# Altium schematic sheet 2 - Control.SchDoc
size A4
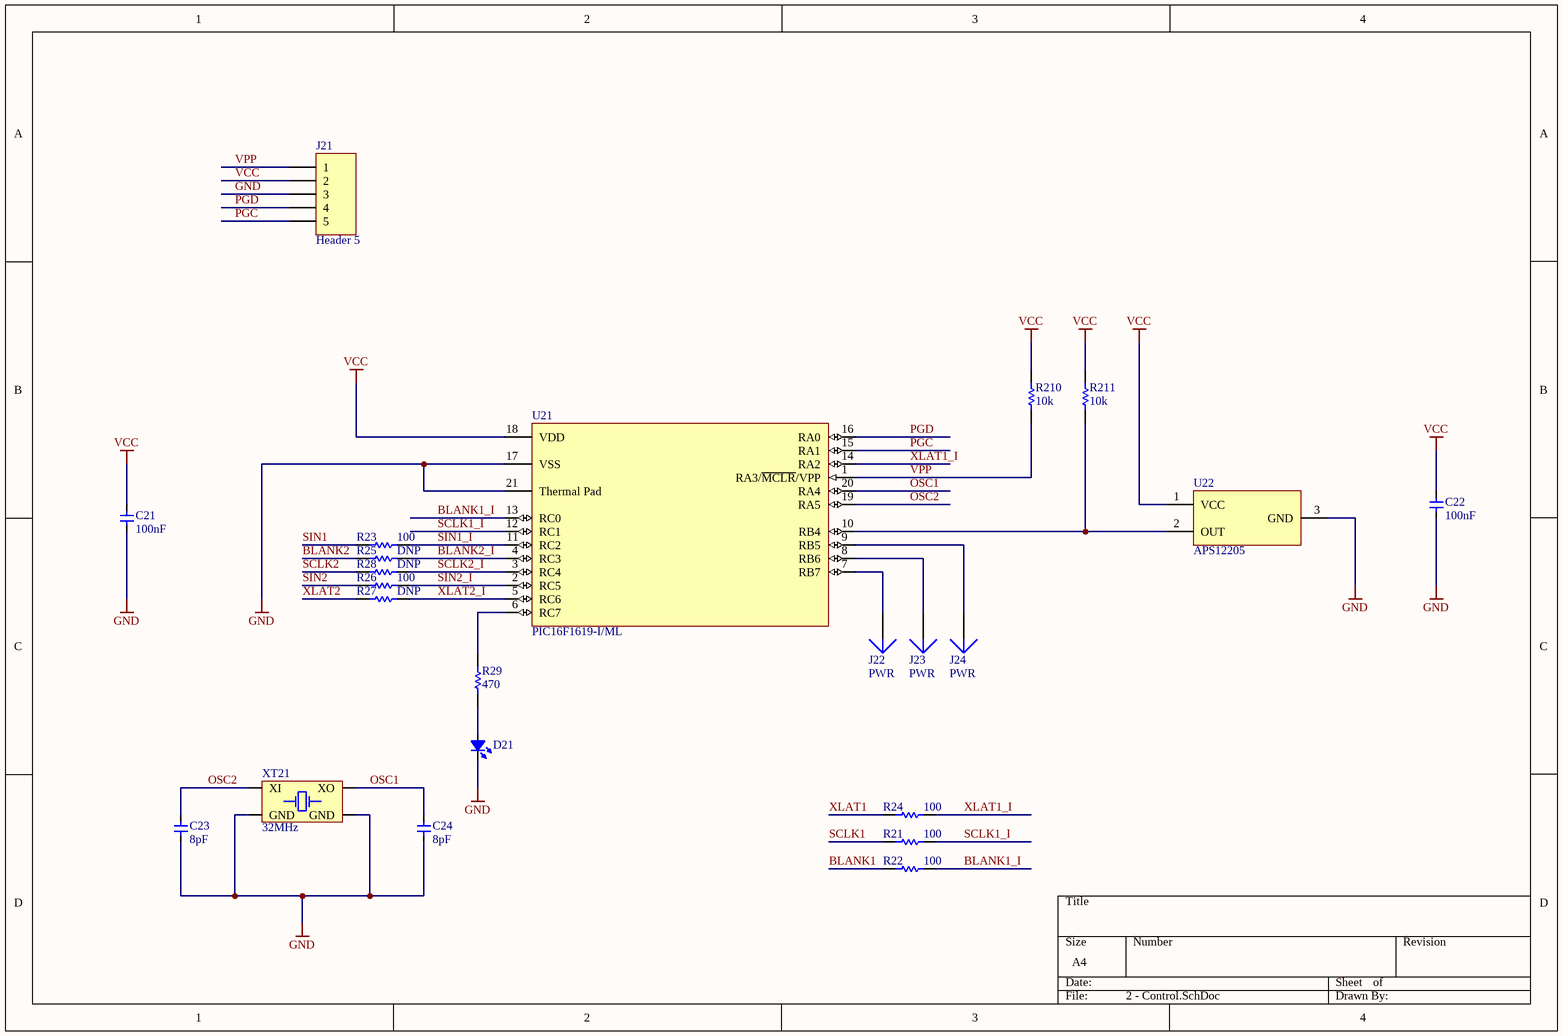
[diagram p0: 2 - Control.SchDoc]

## Parts
C21  value 100nF  [CAP_0603]  (hidden comment: Cap_0603)
C22  value 100nF  [CAP_0603]  (hidden comment: Cap_0603)
C23  value 8pF  [CAP_0603]  (hidden comment: Cap_0603)
C24  value 8pF  [CAP_0603]  (hidden comment: Cap_0603)
D21  LED_0603  [LED_0603_RED]  (value not drawn)
J21  Header 5  [HDR1X5]
J22  PWR  [PIN1]
J23  PWR  [PIN1]
J24  PWR  [PIN1]
R21  value 100  [RES_0603]  (hidden comment: Res1)
R22  value 100  [RES_0603]  (hidden comment: Res1)
R23  value 100  [RES_0603]  (hidden comment: Res1)
R24  value 100  [RES_0603]  (hidden comment: Res1)
R25  value DNP  [RES_0603]  (hidden comment: Res1)
R26  value 100  [RES_0603]  (hidden comment: Res1)
R27  value DNP  [RES_0603]  (hidden comment: Res1)
R28  value DNP  [RES_0603]  (hidden comment: Res1)
R29  value 470  [RES_0603]  (hidden comment: Res1)
R210  value 10k  [RES_0603]  (hidden comment: Res1)
R211  value 10k  [RES_0603]  (hidden comment: Res1)
U21  PIC16F1619-I/ML  [QFN-ML20_M]
U22  APS12205  [SOT23-3]
XT21  value 32MHz  [XT_2520_4]  (hidden comment: XTAL_2520_4P)

## Nets
GND: C21.1 C22.1 C23.1 C24.1 D21.2(K) J21.3 U21.17(VSS) U21.21(Thermal_Pad) U22.3(GND) XT21.2(GND) XT21.4(GND)
VCC: C21.2 C22.2 J21.2 R210.2 R211.2 U21.18(VDD) U22.1(VCC)
BLANK1: R22.2
BLANK1_I: R22.1 U21.13(RC0)
BLANK2: R25.2
BLANK2_I: R25.1 U21.4(RC3)
OSC1: C24.2 U21.20(RA4) XT21.3(XO)
OSC2: C23.2 U21.19(RA5) XT21.1(XI)
PGC: J21.5 U21.15(RA1)
PGD: J21.4 U21.16(RA0)
SCLK1: R21.2
SCLK1_I: R21.1 U21.12(RC1)
SCLK2: R28.2
SCLK2_I: R28.1 U21.3(RC4)
SIN1: R23.2
SIN1_I: R23.1 U21.11(RC2)
SIN2: R26.2
SIN2_I: R26.1 U21.2(RC5)
VPP: J21.1 R210.1 U21.1(RA3/~{MCLR}/VPP)
XLAT1: R24.2
XLAT1_I: R24.1 U21.14(RA2)
XLAT2: R27.2
XLAT2_I: R27.1 U21.5(RC6)
NetD21_1: D21.1(A) R29.1
NetJ22_1: J22.1 U21.7(RB7)
NetJ23_1: J23.1 U21.8(RB6)
NetJ24_1: J24.1 U21.9(RB5)
NetR29_2: R29.2 U21.6(RC7)
NetR211_1: R211.1 U21.10(RB4) U22.2(OUT)

## Library data of the parts
C21-C24 = Cap_0603: Capacitor
D21 = LED_0603: LED
J21 = Header 5: Header, 5-Pin; LatestRevisionDate: 17-Jul-2002; LatestRevisionNote: Re-released for DXP Platform.; Publisher: Altium Limited
J22-J24 = Plug: LatestRevisionDate: 17-Jul-2002; LatestRevisionNote: Re-released for DXP Platform.; Publisher: Altium Limited
R21-R29 R210 R211 = Res1: Resistor; Published: 8-Jun-2000; LatestRevisionDate: 17-Jul-2002; LatestRevisionNote: Re-released for DXP Platform.; PackageReference: AXIAL-0.3; Publisher: Altium Limited; PackageDescription: Axial Device, Thru-Hole; 2 Leads; 0.3 in Pin Spacing
U21 = PIC16F1619-I/ML: PIC PIC® XLP™ 16F Microcontroller IC 8-Bit 32MHz 14KB (8K x 14) FLASH 20-QFN (4x4); Published: 2-Dec-2009; DatasheetVersion: revC, May-2016; PackageVersion: revBB, Aug-2009; PackageReference: QFN-ML20; Publisher: Altium Limited; PackageDescription: 20-Lead Plastic Quad Flat, No Lead Package (ML) - 4x4x0.9 mm Body [QFN]; Supplier 1: Digi-Key; Supplier Part Number 1: PIC16F1619-I/ML-ND; ComponentLink1Description: Datasheet; ComponentLink1URL: http://ww1.microchip.com/downloads/en/DeviceDoc/40001770C.pdf; ComponentLink2Description: Packaging Specification; ComponentLink2URL: http://www.microchip.com/stellent/groups/techpub_sg/documents/packagingspec/en012702.pdf; ComponentLink3Description: Microchip.com Home; ComponentLink3URL: http://www.microchip.com/
U22 = A32xx: Sensor Hall; URL: https://www.digikey.com/product-detail/en/allegro-microsystems-llc/APS12205LLHALU/620-1853-ND/6685340
XT21 = XTAL_2520_4P: Crystal Oscillator